# EAGLE design BlinkyBoard (EAGLE 6.2)
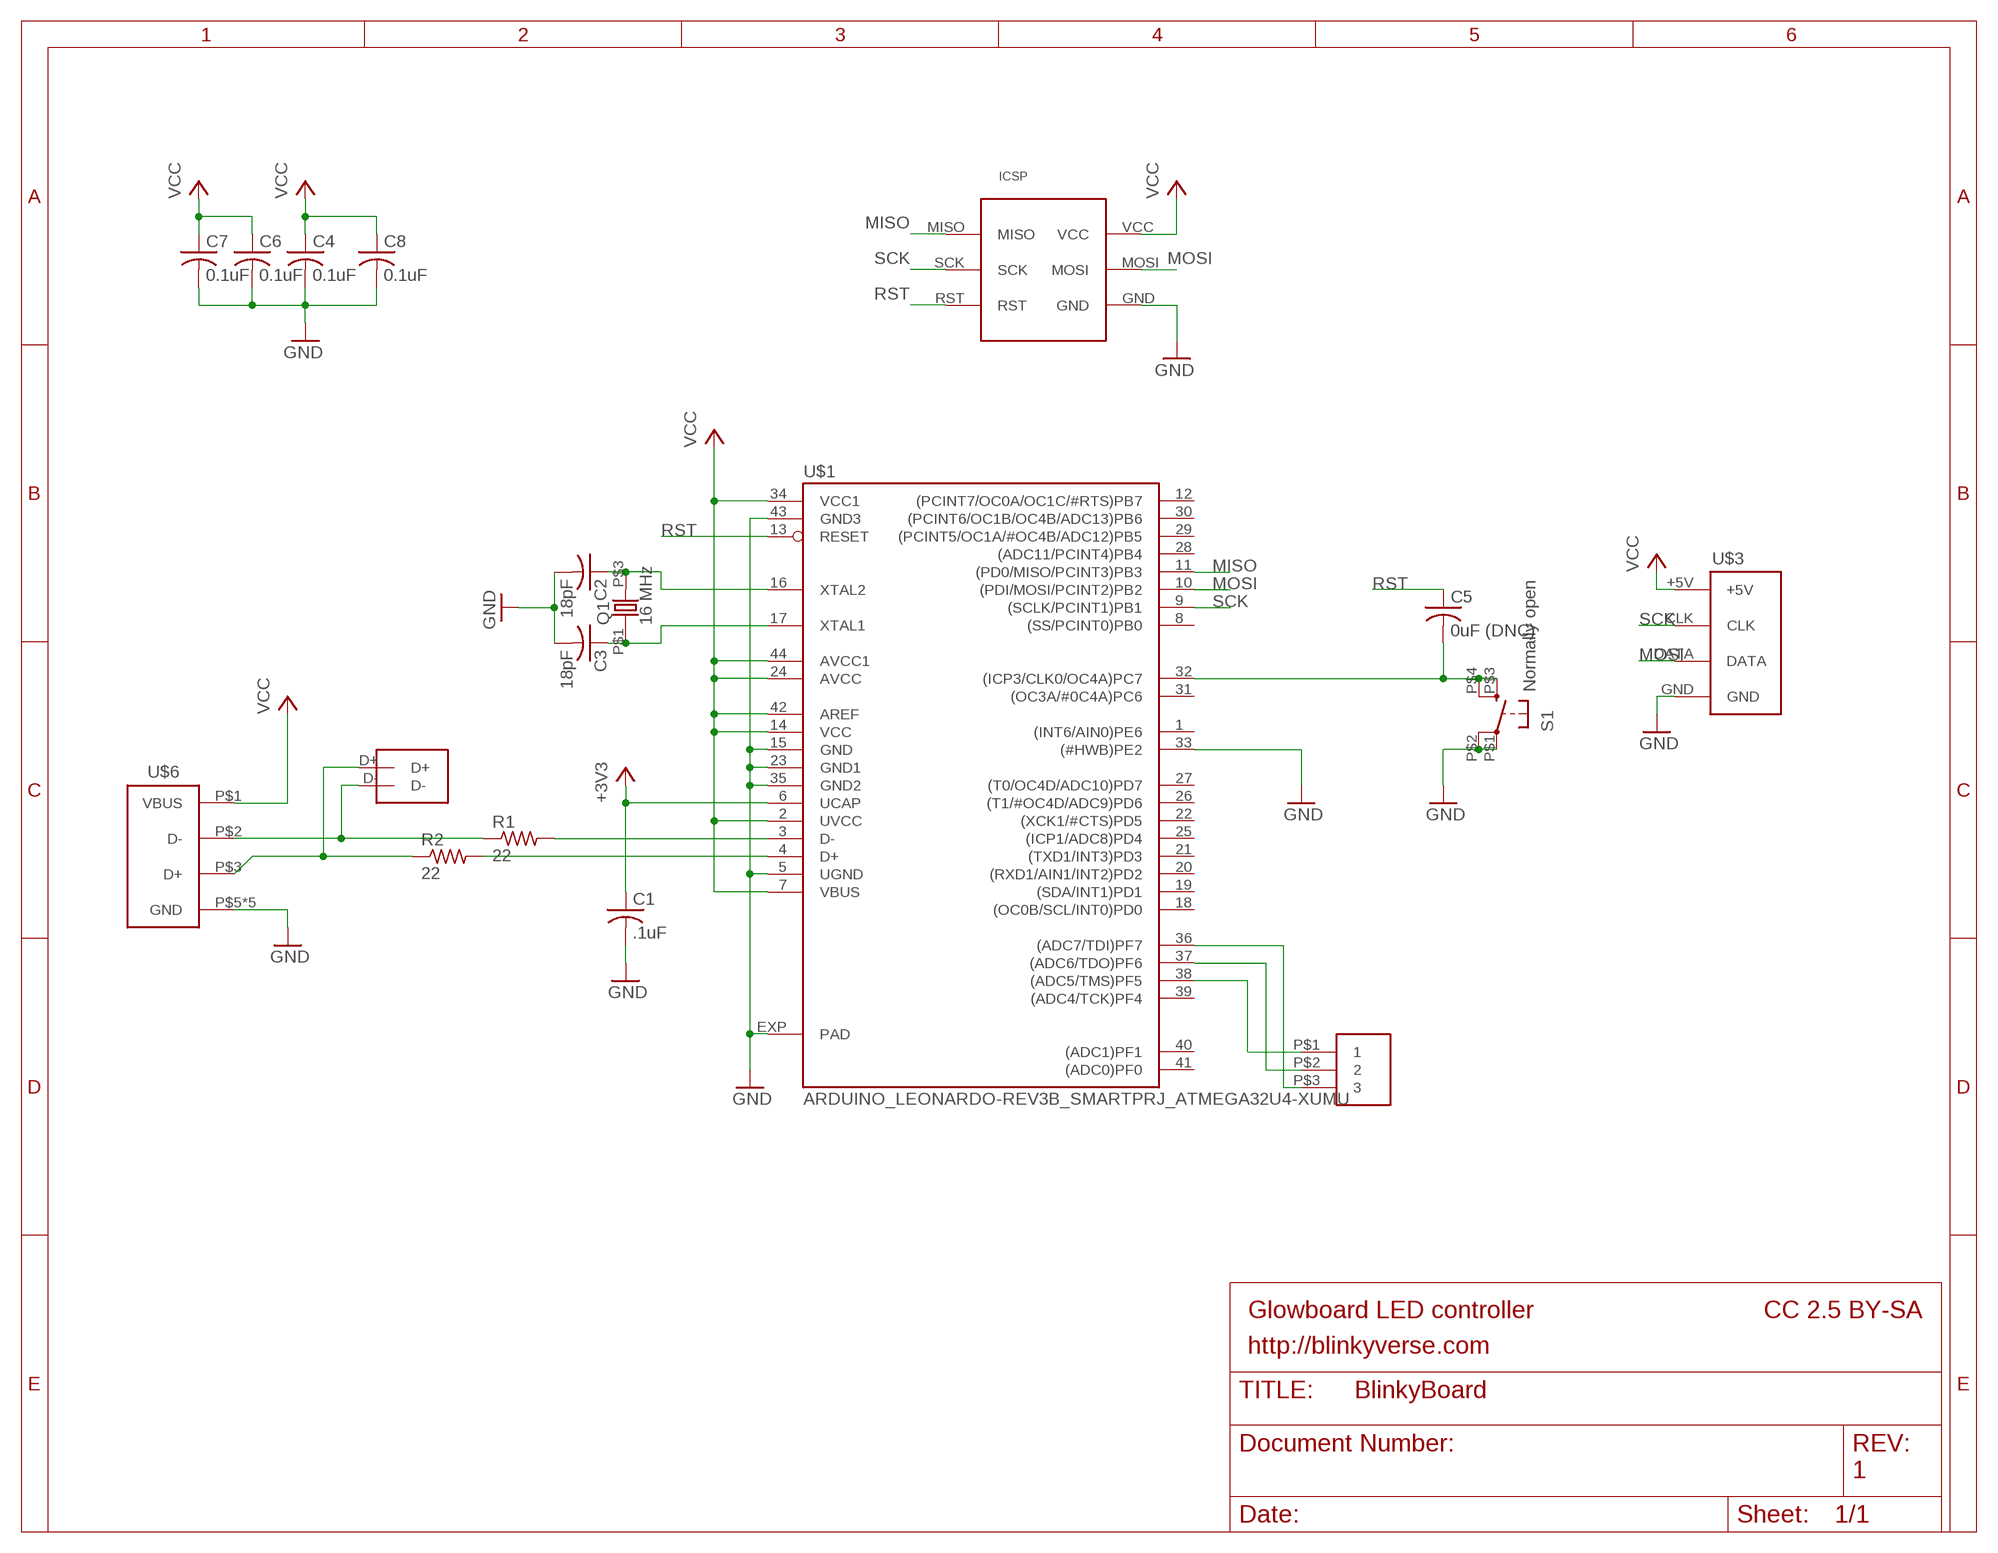
[diagram p0: schematic, sheet 1]

## Parts
C1  .1uF  C-USC0805K  [C0805K]
C2  18pF  C-USC0805K  [C0805K]
C3  18pF  C-USC0805K  [C0805K]
C4  0.1uF  C-USC0805K  [C0805K]
C5  0uF (DNC)  C-USC0805K  [C0805K]
C6  0.1uF  C-USC0805K  [C0805K]
C7  0.1uF  C-USC0805K  [C0805K]
C8  0.1uF  C-USC0805K  [C0805K]
Q1  16 MHz  ABMM2  [ABMM2_CRYSTAL]
R1  22  RESISTOR_0805  [ADAFRUIT_R0805]
R2  22  RESISTOR_0805  [ADAFRUIT_R0805]
S1  Normally open  GLOWBOARD_KMR211G  [GLOWBOARD_KMR211G_SWITCH]
U$1  ARDUINO_LEONARDO-REV3B_SMARTPRJ_ATMEGA32U4-XUMU  [ARDUINO_LEONARDO-REV3B_SMARTPRJ_QFN44ML7X7]
U$2  GLOWBOARD_USB_TEST_PADS  [GLOWBOARD_USB_TEST_PADS]
U$3  GLOWBOARD_PAD_CONNECTION  [GLOWBOARD_PAD_CONNECTION]
U$4  GLOWBOARD_ICSP  [GLOWBOARD_ICSP_PADS]
U$5  GLOWBOARD_EXPANSION_HEADER  [GLOWBOARD_EXPANSION_HEADER]
U$6  GLOWBOARD_MINI_USB  [GLOWBOARD_MINI_USB_PADS]

## Nets
+3V3: C1.1 U$1.6(UCAP)
D+: R2.2 U$1.4(D+)
D+_IN: R2.1 U$2.D+ U$6.P$3(D+)
D-: R1.2 U$1.3(D-)
D-_IN: R1.1 U$2.D- U$6.P$2(D-)
GND: C1.2 C2.2 C3.2 C4.2 C6.2 C7.2 C8.2 S1.P$1(P) S1.P$2(P1) U$1.5(UGND) U$1.15(GND) U$1.23(GND1) U$1.33((#HWB)PE2) U$1.35(GND2) U$1.43(GND3) U$1.EXP(PAD) U$3.GND U$4.GND U$6.P$5(GND) U$6.P$6(GND) U$6.P$7(GND) U$6.P$8(GND) U$6.P$9(GND)
MISO: U$1.11((PD0/MISO/PCINT3)PB3) U$4.MISO
MOSI: U$1.10((PDI/MOSI/PCINT2)PB2) U$3.DATA U$4.MOSI
N$1: U$1.38((ADC5/TMS)PF5) U$5.P$1
N$6: U$1.37((ADC6/TDO)PF6) U$5.P$2
N$7: U$1.36((ADC7/TDI)PF7) U$5.P$3
N$8: C2.1 Q1.P$3 U$1.16(XTAL2)
N$9: C3.1 Q1.P$1 U$1.17(XTAL1)
N$10: C5.2 S1.P$3(S) S1.P$4(S1) U$1.32((ICP3/CLK0/OC4A)PC7)
RST: C5.1 U$1.13(RESET) U$4.RST
SCK: U$1.9((SCLK/PCINT1)PB1) U$3.CLK U$4.SCK
VCC: C4.1 C6.1 C7.1 C8.1 U$1.2(UVCC) U$1.7(VBUS) U$1.14(VCC) U$1.24(AVCC) U$1.34(VCC1) U$1.42(AREF) U$1.44(AVCC1) U$3.+5V U$4.VCC U$6.P$1(VBUS)
Unconnected: U$1.1((INT6/AIN0)PE6) U$1.8((SS/PCINT0)PB0) U$1.12((PCINT7/OC0A/OC1C/#RTS)PB7) U$1.18((OC0B/SCL/INT0)PD0) U$1.19((SDA/INT1)PD1) U$1.20((RXD1/AIN1/INT2)PD2) U$1.21((TXD1/INT3)PD3) U$1.22((XCK1/#CTS)PD5) U$1.25((ICP1/ADC8)PD4) U$1.26((T1/#OC4D/ADC9)PD6) U$1.27((T0/OC4D/ADC10)PD7) U$1.28((ADC11/PCINT4)PB4) U$1.29((PCINT5/OC1A/#OC4B/ADC12)PB5) U$1.30((PCINT6/OC1B/OC4B/ADC13)PB6) U$1.31((OC3A/#0C4A)PC6) U$1.39((ADC4/TCK)PF4) U$1.40((ADC1)PF1) U$1.41((ADC0)PF0)

## Notes on the sheet
- Glowboard LED controller | CC 2.5 BY-SA
- http://blinkyverse.com
- 1

## Library data of the parts
C1-C8 = adafruit:C-US: CAPACITOR, American symbol
Q1 = glowboard:ABMM2: CRYSTAL
R1 R2 = blinkyboard:RESISTOR_0805
S1 = blinkyboard:GLOWBOARD_KMR211G: KMR211G SWITCH
U$1 = blinkyboard:ARDUINO_LEONARDO-REV3B_SMARTPRJ_ATMEGA32U4-XU
U$2 = blinkyboard:GLOWBOARD_USB_TEST_PADS
U$3 = blinkyboard:GLOWBOARD_PAD_CONNECTION
U$4 = blinkyboard:GLOWBOARD_ICSP
U$5 = blinkyboard:GLOWBOARD_EXPANSION_HEADER
U$6 = blinkyboard:GLOWBOARD_MINI_USB

## Board
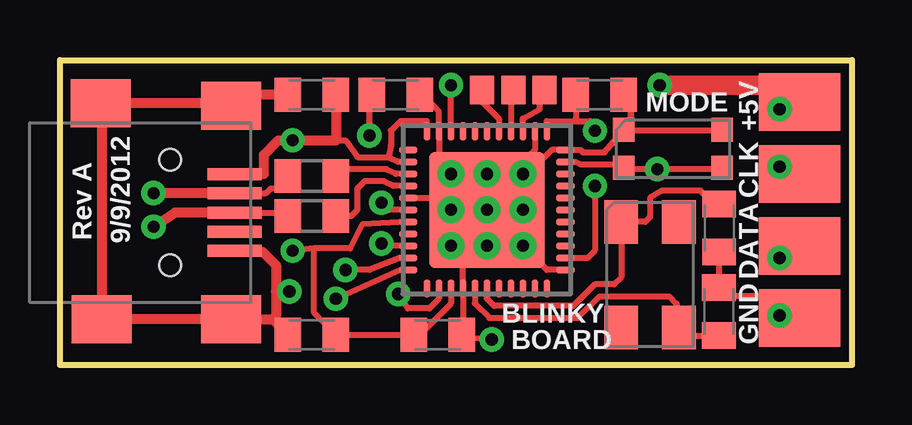
[diagram p1: board, top side]
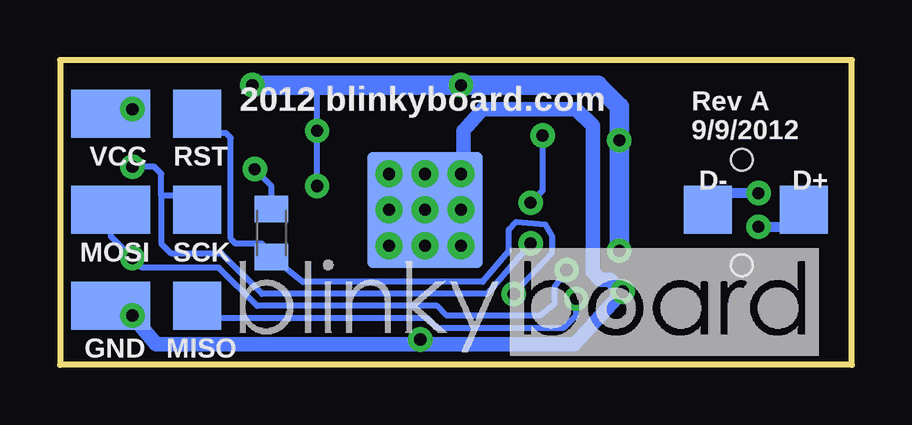
[diagram p2: board, bottom side, seen from below]

Size 33.02 x 12.7 mm. Coordinates in mm from the lower left corner, seen from the top.
Outline: 0,0 0,12.7 33.02,12.7 33.02,0 0,0
Copper layers (1*16): Top 0.035mm / dielectric 1.5mm / Bottom 0.035mm
Design rules: minimum track width 8mil, minimum drill 0.5mm, track to track 8mil, track to pad 8mil, pad to pad 8mil, via to via 8mil, smd to smd 8mil, copper to edge 10mil, drill to drill 8mil, minimum pad ring 12mil, minimum via ring 10mil, stop-mask expansion 4mil, vias tented up to drill 25mil, thermal gap 10mil

### Footprints (pad centres in the part's own frame; a part is rotated, then mirrored left to right if it is on the bottom)
C0805K = smd 1.1 x 1.4: 1 -1,0; 2 1,0
ABMM2_CRYSTAL = smd 1.8 x 1.4: P$1 -2.1,-1.2; P$2 2.3,-1.2; P$3 2.3,1.2; P$4 -2.1,1.2
ADAFRUIT_R0805 = smd 1.1 x 1.4: 1 -1,0; 2 1,0
GLOWBOARD_KMR211G_SWITCH = smd 0.9 x 1: P$1 -2,0.8; P$2 2.1,0.8; P$3 -2,-0.8; P$4 2.1,-0.8
ARDUINO_LEONARDO-REV3B_SMARTPRJ_QFN44ML7X7 = smd 0.75 x 0.275: 1 -3.275,2.5; 2 -3.275,2; 3 -3.275,1.5; 4 -3.275,1; 5 -3.275,0.5; 6 -3.275,0; 7 -3.275,-0.5; 8 -3.275,-1; 9 -3.275,-1.5; 10 -3.275,-2; 11 -3.275,-2.5; 23 3.275,-2.5; 24 3.275,-2; 25 3.275,-1.5; 26 3.275,-1; 27 3.275,-0.5; 28 3.275,0; 29 3.275,0.5; 30 3.275,1; 31 3.275,1.5; 32 3.275,2; 33 3.275,2.5 | smd 0.275 x 0.75: 12 -2.5,-3.275; 13 -2,-3.275; 14 -1.5,-3.275; 15 -1,-3.275; 16 -0.5,-3.275; 17 0,-3.275; 18 0.5,-3.275; 19 1,-3.275; 20 1.5,-3.275; 21 2,-3.275; 22 2.5,-3.275; 34 2.5,3.275; 35 2,3.275; 36 1.5,3.275; 37 1,3.275; 38 0.5,3.275; 39 0,3.275; 40 -0.5,3.275; 41 -1,3.275; 42 -1.5,3.275; 43 -2,3.275; 44 -2.5,3.275 | smd 4.826 x 4.826: EXP 0,0 | smd 4.826 x 4.826 bottom: EXP1 0,0 | drill 0.508: P$1 0,0; P$2 -1.5,-1.5; P$3 -1.5,1.5; P$5 1.5,-1.5; P$7 0,-1.5; P$8 -1.5,0; P$12 1.5,0; P$14 0,1.5; P$15 1.5,1.5
GLOWBOARD_USB_TEST_PADS = smd 2 x 2 bottom: D+ -2,0; D- 2,0
GLOWBOARD_PAD_CONNECTION = smd 3.4 x 2.4: +5V 0,4.6; CLK 0,1.6; DATA 0,-1.4; GND 0,-4.4
GLOWBOARD_ICSP_PADS = smd 3.3 x 2 bottom: GND 2,-4; MOSI 2,0; VCC 2,4 | smd 2 x 2 bottom: MISO -1.6,-4; RST -1.6,4; SCK -1.6,0
GLOWBOARD_EXPANSION_HEADER = smd 1 x 1.2: P$1 -1.3,0; P$2 0,0; P$3 1.3,0
GLOWBOARD_MINI_USB_PADS = smd 0.5 x 2.25: P$1 -0.99,2.99; P$2 -0.19,2.99; P$3 0.61,2.99; P$4 1.41,2.99; P$5 2.21,2.99 | smd 2 x 2.5: P$6 -3.84,2.84; P$7 -3.94,-2.61; P$8 5.06,2.84; P$9 5.06,-2.56 | hole 0.9: -1.59,0.29; 2.81,0.29

### Placement (x,y rotation side)
C1  14,11.25 0 top
C2  27.47,2.21 90 top
C3  27.49,5.7 270 top
C4  10.5,11.25 180 top
C5  24.2,5.5 90 bottom
C6  22.5,11.25 0 top
C7  15.75,1.25 0 top
C8  10.5,1.25 180 top
Q1  24.6,3.85 270 top
R1  10.5,7.87 0 top
R2  10.5,6.21 0 top
S1  25.5,9 0 top
U$1  17.8,6.45 0 top
U$2  4,6.45 0 top
U$3  30.84,6.35 0 top
U$4  28.9,6.45 0 top
U$5  18.9,11.45 0 top
U$6  4.3,6.95 270 top

### Tracks (layer width: path | path; a pad name or v marks a point on that pad's centre or on a via)
+3V3  (via drill 0.51)
  Top 0.254: U$1.6 13.7,6.45 v13.4,6.75 | v12.9,9.55 12.9,11.06 C1.1
  Bottom 0.254: 13.3,6.85 v13.4,6.75 12.9,7.25 v12.9,9.55
D+
  Top 0.254: R2.2 12.15,6.21 12.4,6.45 12.4,7.35 12.7,7.65 13.5,7.65 13.9,7.45 U$1.4
D+_IN  (via drill 0.51)
  Top 0.254: 9.45,6.31 R2.1 9.54,6.34 U$6.P$3
  Top 0.406: U$6.P$3 4.8,6.34 v3.9,5.75
  Bottom 0.406: v3.9,5.75 2,5.75 U$2.D+
D-
  Top 0.254: 11.69,7.87 R1.2 12.09,8.15 13.6,8.15 14,7.95 U$1.3
D-_IN  (via drill 0.51)
  Top 0.254: R1.1 9.66,7.35 8.8,7.35 8.6,7.15 7.1,7.15 U$6.P$2
  Top 0.406: 7.1,7.15 v3.9,7.15
  Bottom 0.406: v3.9,7.15 5.3,7.15 U$2.D-
GND  (via drill 0.51)
  Top 0.254: U$1.EXP 17.8,5.45 16.8,5.45 U$1.15 16.8,1.35 C7.2 16.82,1.15 v18,1.05 | U$1.5 17.8,6.95 | 17.8,6.95 U$1.EXP | U$1.23 20.3,3.95 U$1.EXP | U$1.EXP 15.8,8.45 U$1.43 15.8,10.55 15.4,10.95 15.4,11.05 C1.2 | C3.2 27.47,4.38 C2.2 27.83,2.85 29.8,2.85 29.8,2.05 v30,2.05 | U$1.35 19.8,8.95 19.65,8.8 | 19.65,8.8 17.8,6.95 | 23.8,10.75 23.8,10.76 23.5,11.36 C6.2 | 23.8,10.75 23.8,9.85 S1.P$1 22.7,8.85 21.8,8.85 21.7,8.95 U$1.33 20.5,8.95 20,8.45 19.65,8.8 | U$6.P$7 1.74,10.64 | U$6.P$6 6.84,10.89 | S1.P$2 27.5,9.75 23.8,9.75 23.8,10.75
  Top 0.406: 1.74,10.64 U$6.P$9 U$6.P$8 8.86,1.89 | 6.84,10.89 U$6.P$7 | U$6.P$5 7.13,4.7 8.45,4.7 9,4.15 9,3.05 | C4.2 7.6,11.25 U$6.P$6 | 8.86,1.89 C8.2 | 9,3.05 9,2.03 8.86,1.89 | v9.56,3.05 9,3.05
  Top 0.813: U$3.GND 30.12,1.87 v30,2.05
  Bottom 0.254: v18,1.05 18.1,0.85
  Bottom 0.61: v9.56,3.05 11.56,0.85 18.1,0.85 29,0.85 v30,2.05
  Bottom 0.813: U$4.GND 30.3,1.85 v30,2.05
MISO  (via drill 0.51)
  Top 0.254: U$1.11 14.2,3.95 v11.5,2.75
  Bottom 0.254: v11.5,2.75 11.5,2.05 12,1.55 17.3,1.55 17.7,1.95 27.3,1.95 U$4.MISO
MOSI  (via drill 0.51)
  Top 0.254: U$3.DATA 30.42,4.45 v30,4.45 | U$1.10 14.2,4.45 12.9,3.95 v11.9,3.95
  Bottom 0.254: v11.9,3.95 12.4,3.25 12.4,2.55 13,2.05 16.9,2.05 17.3,2.45 24.8,2.45 26.4,4.05 29.6,4.05 v30,4.45 30.9,5.35 U$4.MOSI
N$1
  Top 0.254: U$5.P$1 17.6,10.95 18.3,10.25 U$1.38
N$6
  Top 0.254: U$5.P$2 18.9,11.25 18.8,11.15 U$1.37
N$7
  Top 0.254: U$1.36 19.3,10.25 20,10.65 20,11.25 U$5.P$3
N$8
  Top 0.254: U$1.16 17.3,2.55 17.9,1.95 21.6,1.95 22.5,2.85 25.4,2.85 25.7,2.55 25.7,1.65 Q1.P$3 26.14,1.21 C2.1
N$9
  Top 0.254: C3.1 26.99,6.97 26.7,7.25 25.1,7.25 24.6,6.95 24.6,6.15 24.4,5.95 Q1.P$1 23.4,3.65 23.1,3.35 22.3,3.35 21.4,2.45 18.1,2.45 17.8,2.75 U$1.17
N$10  (via drill 0.51)
  Top 0.254: U$1.32 21.5,8.45 21.7,8.35 23.6,8.35 S1.P$3 23.55,8.15 v24.9,8.15 27.5,8.15 S1.P$4
  Bottom 0.254: C5.2 24.2,7.45 v24.9,8.15
N$11
  Bottom 0.61: 16.2,7.95 16.2,9.75 15.4,10.65 11.5,10.65 10.8,9.95 10.8,3.85 10.5,3.55 10.1,3.55 9.6,3.05
RST  (via drill 0.51)
  Top 0.254: U$1.13 15.8,2.75 15.4,2.35 14.5,2.35 v14.1,2.95
  Bottom 0.254: U$4.RST 26.5,9.65 26.1,9.65 25.9,9.45 25.9,5.25 25.7,5.05 24.6,5.05 C5.1 22.9,3.45 15.4,3.45 14.3,4.75 14.3,5.65 14,5.95 12.8,5.85 12.5,5.35 12.5,4.65 v14.1,2.95
SCK  (via drill 0.51)
  Top 0.254: U$1.9 13.8,4.95 v13.4,5.05 | v30,8.25 30.08,7.87 U$3.CLK
  Bottom 0.254: 28.8,7.05 27.9,7.05 U$4.SCK 26.8,6.75 | v13.4,5.05 15.2,2.95 24.6,2.95 26.3,4.65 28.4,4.65 28.8,5.05 28.8,7.05 | 28.8,7.05 28.8,7.95 29.1,8.25 v30,8.25
VCC  (via drill 0.51)
  Top 0.254: U$1.14 16.3,2.55 15,1.25 C7.1 C8.1 10.6,2.15 10.6,4.85 | U$1.7 12.6,5.85 12.1,4.85 10.6,4.85 | U$1.24 22,4.45 22.3,4.75 v22.3,7.45 | U$1.42 v16.3,11.65 | U$1.34 20.3,10.15 21.6,10.15 | 21.6,10.15 22.1,10.15 v22.3,9.75 | U$1.2 14.1,8.45 13.7,8.65 | 11.5,9.35 11.9,9.35 12.4,8.65 13.7,8.65 | U$1.44 15.3,10.15 14.2,10.15 13.8,9.75 13.8,9.15 13.7,8.65 | C6.1 21.5,10.25 21.6,10.15 | 10.6,4.85 v9.7,4.75
  Top 0.406: U$6.P$1 8.39,7.94 8.5,7.95 8.5,8.75 9.1,9.35 v9.7,9.35 11.5,9.35 C4.1
  Top 0.813: v25,11.65 29.5,11.65 v30,10.65 30.82,10.85 U$3.+5V
  Bottom 0.254: 22.3,11.65 v22.3,9.75 v22.3,7.45
  Bottom 0.813: v25,11.65 22.3,11.65 v16.3,11.65 10.6,11.65 9.7,10.75 v9.7,9.35 v9.7,4.75 | U$4.VCC 30.5,10.85 v30,10.65

### Text on the board
tPlace: MODE | 9/9/2012 | +5V | Rev A | CLK | DATA | BLINKY | BOARD | GND
bPlace: Rev A | 2012 blinkyboard.com | 9/9/2012 | RST | VCC | D+ | D- | SCK | MOSI | MISO | GND